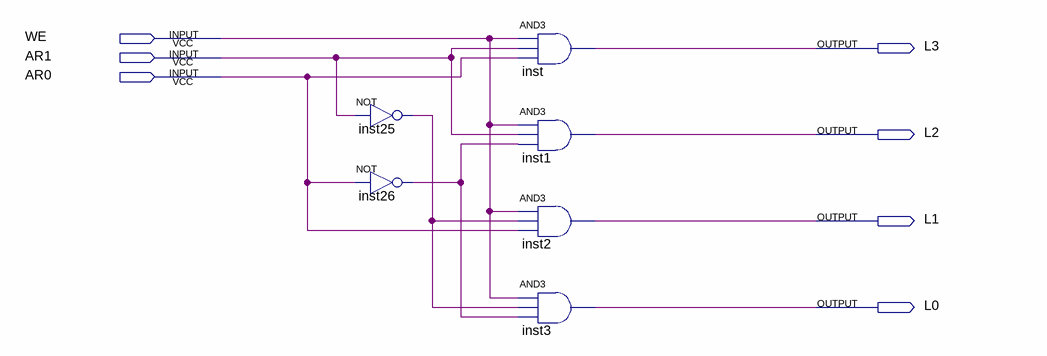
[diagram p0: schematic sheet]
// Quartus schematic 2_4WE.bdf as structural Verilog: 6 symbols, 7 pins
module \2_4WE  (
  input  WE,
  input  AR1,
  input  AR0,
  output L3,
  output L2,
  output L1,
  output L0
);

  wire inst25_out, inst26_out;

  not inst25 (inst25_out, AR1);
  not inst26 (inst26_out, AR0);
  and inst (L3, WE, AR1, AR0);
  and inst1 (L2, WE, AR1, inst26_out);
  and inst2 (L1, WE, inst25_out, AR0);
  and inst3 (L0, WE, inst25_out, inst26_out);
endmodule
